# Altium schematic sheet 05-AD9546_StrapsXtal.SchDoc
size A; SheetNumber: 5; SheetTotal: 16
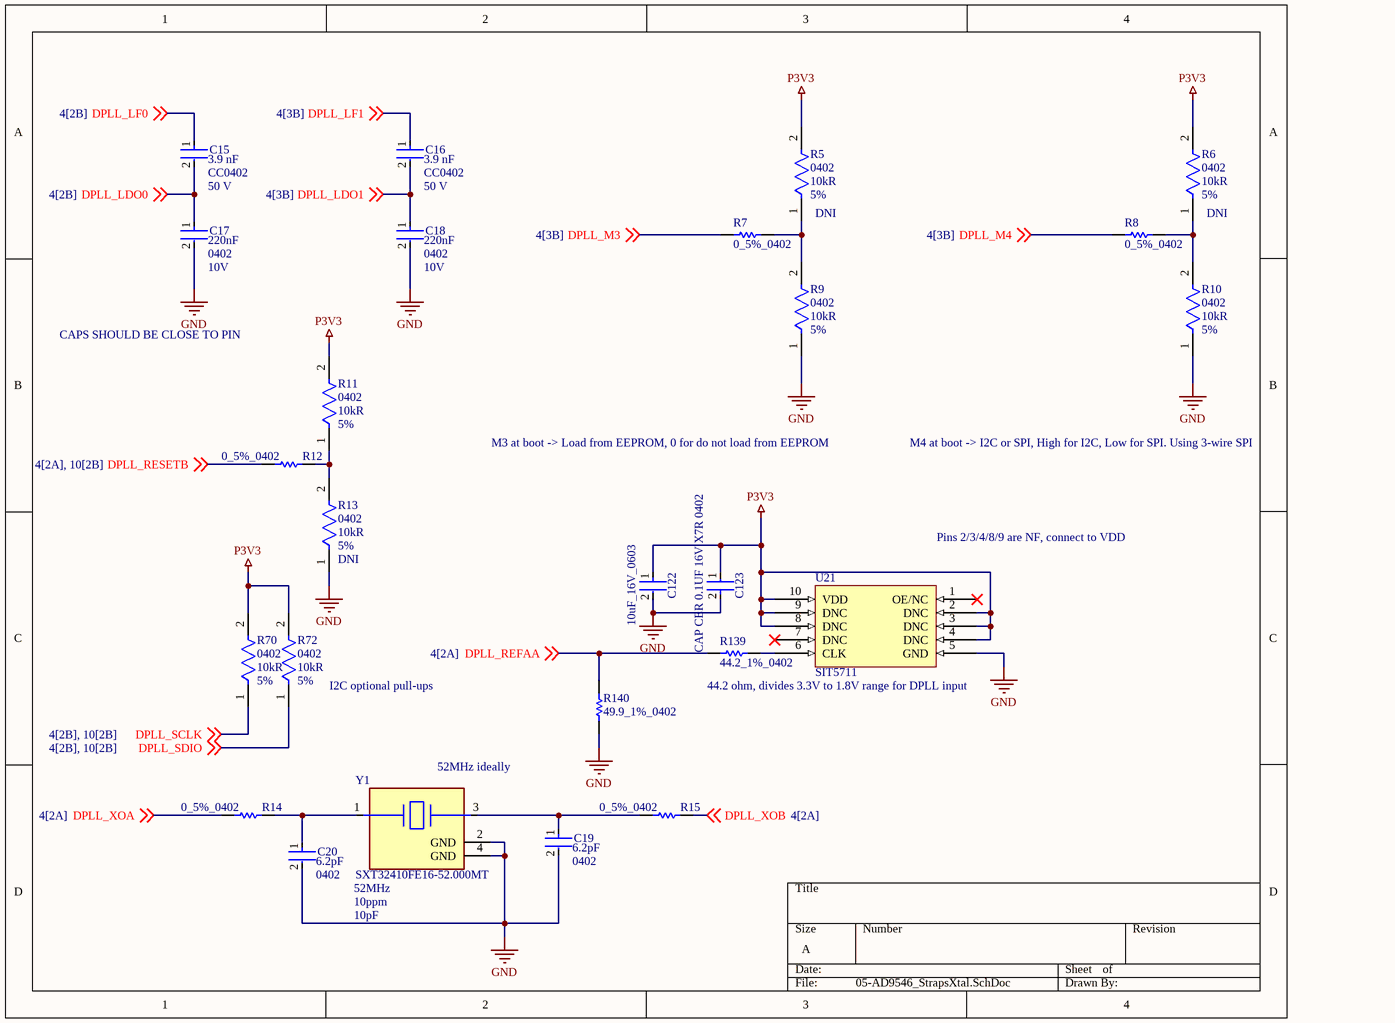
[diagram p0: 05-AD9546_StrapsXtal.SchDoc]

## Parts
C15  value 3.9 nF  Voltage Rating: 50 V  Package: CC0402  [FP-CC0402-MFG]  (hidden comment: CC0402KRX7R9BB392)
C16  value 3.9 nF  Voltage Rating: 50 V  Package: CC0402  [FP-CC0402-MFG]  (hidden comment: CC0402KRX7R9BB392)
C17  Voltage: 10V  Case/Package: 0402  Capacitance: 220nF  [FP-GRM155-0_05-IPC_A]  (hidden comment: GRM155R61A224KE19D)
C18  Voltage: 10V  Case/Package: 0402  Capacitance: 220nF  [FP-GRM155-0_05-IPC_A]  (hidden comment: GRM155R61A224KE19D)
C19  Case/Package: 0402  Capacitance: 6.2pF  [FP-CL468-IPC_C]  (hidden comment: CL05C6R2CB5NNNC)
C20  Case/Package: 0402  Capacitance: 6.2pF  [FP-CL468-IPC_C]  (hidden comment: CL05C6R2CB5NNNC)
C122  10uF_16V_0603  [FP-C1608-MFG]
C123  GRM155R71C104KA88D  [FP-GRM15-MFG]  (value not drawn)
R5  Case/Package: 0402  Resistance: 10kR  Tolerance: 5%  [FP-CRCW0402-e3-IPC_B]  (hidden comment: CRCW040210K0JNED)  (no BOM)
R6  Case/Package: 0402  Resistance: 10kR  Tolerance: 5%  [FP-CRCW0402-e3-IPC_B]  (hidden comment: CRCW040210K0JNED)  (no BOM)
R7  0_5%_0402  [RESC1005X40X25ML05T10]
R8  0_5%_0402  [RESC1005X40X25ML05T10]
R9  Case/Package: 0402  Resistance: 10kR  Tolerance: 5%  [FP-CRCW0402-e3-IPC_B]  (hidden comment: CRCW040210K0JNED)
R10  Case/Package: 0402  Resistance: 10kR  Tolerance: 5%  [FP-CRCW0402-e3-IPC_B]  (hidden comment: CRCW040210K0JNED)
R11  Case/Package: 0402  Resistance: 10kR  Tolerance: 5%  [FP-CRCW0402-e3-IPC_B]  (hidden comment: CRCW040210K0JNED)
R12  0_5%_0402  [RESC1005X40X25LL10T10]
R13  Case/Package: 0402  Resistance: 10kR  Tolerance: 5%  [FP-CRCW0402-e3-IPC_B]  (hidden comment: CRCW040210K0JNED)  (no BOM)
R14  0_5%_0402  [RESC1005X40X25LL10T10]
R15  0_5%_0402  [RESC1005X40X25LL10T10]
R70  Case/Package: 0402  Resistance: 10kR  Tolerance: 5%  [FP-CRCW0402-e3-IPC_B]  (hidden comment: CRCW040210K0JNED)
R72  Case/Package: 0402  Resistance: 10kR  Tolerance: 5%  [FP-CRCW0402-e3-IPC_B]  (hidden comment: CRCW040210K0JNED)
R139  44.2_1%_0402  [RESC0402(1005)_M]
R140  49.9_1%_0402  [RESC1005X40X25NL05T05]
U21  SIT5711  [SIT5711]
Y1  SXT32410FE16-52.000MT  Frequency: 52MHz  Frequency Stability: 10ppm  Load Capacitance: 10pF  [FP-402-MFG]

## Nets
GND: C17.2 C18.2 C19.2 C20.2 C122.2 C123.2 R9.1 R10.1 R13.1 R140.1 U21.5(GND) Y1.2(GND) Y1.4(GND)
P3V3: C122.1 C123.1 R5.2 R6.2 R11.2 R70.2 R72.2 U21.2(DNC) U21.3(DNC) U21.4(DNC) U21.8(DNC) U21.9(DNC) U21.10(VDD)
DPLL_LDO0: C15.2 C17.1 ; off-sheet DPLL_LDO0
DPLL_LDO1: C16.2 C18.1 ; off-sheet DPLL_LDO1
DPLL_LF0: C15.1 ; off-sheet DPLL_LF0
DPLL_LF1: C16.1 ; off-sheet DPLL_LF1
DPLL_M3: R7.1 ; off-sheet DPLL_M3
DPLL_M4: R8.1 ; off-sheet DPLL_M4
DPLL_REFAA: R139.1 R140.2 ; off-sheet DPLL_REFAA
DPLL_RESETB: R12.1 ; off-sheet DPLL_RESETB
DPLL_SCLK: R70.1 ; off-sheet DPLL_SCLK
DPLL_SDIO: R72.1 ; off-sheet DPLL_SDIO
DPLL_XOA: R14.1 ; off-sheet DPLL_XOA
DPLL_XOB: R15.2 ; off-sheet DPLL_XOB
NetC19_1: C19.1 R15.1 Y1.3
NetC20_1: C20.1 R14.2 Y1.1
NetR5_1: R5.1 R7.2 R9.2
NetR6_1: R6.1 R8.2 R10.2
NetR11_1: R11.1 R12.2 R13.2
NetR139_2: R139.2 U21.6(CLK)

Not connected (* = marked no-connect by the designer): U21 1(OE/NC)* 7(DNC)*

## Notes on the sheet
- CAPS SHOULD BE CLOSE TO PIN
- M3 at boot -> Load from EEPROM, 0 for do not load from EEPROM
- M4 at boot -> I2C or SPI, High for I2C, Low for SPI. Using 3-wire SPI
- Pins 2/3/4/8/9 are NF, connect to VDD
- (near R72) I2C optional pull-ups
- 44.2 ohm, divides 3.3V to 1.8V range for DPLL input
- (near Y1) 52MHz ideally

## Library data of the parts
C15 C16 = CMP-03422-000890-1: CAP CER 3900PF 50V X7R 0402; Manufacturer: YAGEO; Tolerance: 0.1; Temperature Coefficient: 30ppm/°C; Material: Ceramic; Automotive Grade: NA; Digikey Description: CAP CER 3900PF 50V X7R 0402; Octopart: https://octopart.com/cc0402krx7r9bb392-yageo-9291741; Category: Cap; Temperature Characteristic: X7R; Footprint Url: http://www.yageo.com/exep/pages/download/literatures/UPY-C_GEN_24.pdf; Height: 0.55mm; ComponentLink2Description: Datasheet; Capacitance: 3.9 nF; RoHS: TRUE; Device Class L1: Passive Components; ComponentLink2URL: http://www.yageo.com/documents/recent/UPY-GP_NP0_16V-to-50V_16.pdf; Temperature Range Low: -55°C; Automotive: No; Manufacturer Part Number: CC0402KRX7R9BB392; Temperature: -55°C to +125°C; Ipc Land Pattern Name: CAPC10050X50; Device Class L3: Ceramic Capacitors; Device Class L2: Capacitors; Mouser Description: Multilayer Ceramic Capacitors MLCC - SMD/SMT 3.9nF 50V X7R 10%; Lead Free: Yes; Temperature Range High: +125°C
C17 C18 = CMP-2008-04561-5: CAP CER 0.22UF 10V X5R 0402; Tolerance: 10%; Material: Ceramic; Insulation Resistance: 10GR; Package Quantity: 1; Termination: SMD/SMT; Max Operating Temperature: 85°C; REACH SVHC: No SVHC; Thickness: 0.022inch; Mount: Surface Mount; Height: 0.5mm; Length: 1mm; Lead Free: Lead Free; Number of Pins: 2; Case Code (Imperial): 0402; Min Operating Temperature: -55°C; Packaging: Tape and Reel; Dielectric: X5R; Depth: 0.5mm; Series: GRM; Case Code (Metric): 1005; Radiation Hardening: No; RoHS Compliant: Yes; Voltage Rating (DC): 10V; Voltage Rating: 10V; Dielectric Material: Ceramic; Width: 0.5mm
C19 C20 = CMP-13271-000420-1: Cap Ceramic 6.2pF 50V C0G ±0.25pF SMD 0402 +125°C Paper T/R; Radiation Hardening: No; Voltage Rating (DC): 50V; Thickness: 0.022inch; Height: 0.5mm; Case Code (Metric): 1005; Max Operating Temperature: 125°C; Case Code (Imperial): 0402; Voltage Rating: 50V; Min Operating Temperature: -55°C; Width: 0.02inch; Depth: 0.5mm; Length: 1mm; Dielectric: C0G; Packaging: Tape and Reel; Mount: Surface Mount
C122 = CMP-08246-000019-1: CAP CER 10UF 16V X5R 0603; Manufacturer: TDK Corporation; Manufacturer Part Number: C1608X5R1C106M080AB; Temperature Coefficient: 15%; Tolerance: 20%; Material: Ceramic; Octopart: https://octopart.com/c1608x5r1c106m080ab-tdk-26013480; ComponentLink2Description: Datasheet; Value: 10uF; Temperature Range Low: -55°C; Digikey Description: CAP CER 10UF 16V X5R 0603; Package: C1608; Lead Free: Yes; Mouser Description: Multilayer Ceramic Capacitors MLCC - SMD/SMT 0603 10uF 16volts X5R +/-20% GP; Device Class L2: Capacitors; Voltage Rating: 16V; RoHS: TRUE; Automotive: No; Height: 0.9mm; Ipc Land Pattern Name: CAPC16080X80; ComponentLink2URL: https://upverter.com/datasheet/6fbac97fd59b4a24a005814037d2a36a27db40e9.pdf; Temperature Range High: +85°C; Capacitance: 10uF; Temperature: -55°C to +85°C; Category: Cap; Device Class L1: Passive Components; Device Class L3: Ceramic Capacitors; Temperature Characteristic: X5R
C123 = CMP-2100-03641-2: CAP CER 0.1UF 16V X7R 0402; Manufacturer: Murata; Standoff Height: 0mm; Tolerance: 10%; Voltage Rating: 16Vdc; Material: Ceramic; Capacitance: 0.10μF; Value: 0.10μF; RoHS: TRUE; Manufacturer Part Number: GRM155R71C104KA88D; Temperature Characteristic: X7R; Octopart: https://octopart.com/grm155r71c104ka88d-murata-196880; Digikey Description: CAP CER 0.1UF 16V X7R 0402; Device Class L3: Ceramic Capacitors; Height: 0.55mm; ComponentLink2Description: Datasheet; Temperature Range Low: -55°C; Ipc Land Pattern Name: CAPC10050X219; ComponentLink2URL: https://search.murata.co.jp/Ceramy/image/img/A01X/G101/ENG/GRM155R71H471KA01-01A.pdf; Device Class L1: Passive Components; Lead Free: yes; Category: Cap; Package: GRM15; Temperature: -55°C to +125°C; Device Class L2: Capacitors; Temperature Range High: +125°C; Mouser Description: 0402 0.1 uF 16V ±10 % Tolerance X7R SMT Multilayer Ceramic Capacitor
R5 R6 R9-R11 R13 R70 R72 = CMP-2002-08136-3: RES Thick Film, 10kΩ, 5%, 0.063W, 200ppm/°C, 0402; Voltage Rating: 50V; Power Rating: 63mW; Military Standard: Not; Packaging: Tape and Reel; Case Code (Imperial): 0402; Min Operating Temperature: -55°C; Case Code (Metric): 1005; Temperature Coefficient: 200ppm/°C; Termination: SMD/SMT; Composition: Thick Film; Depth: 0.5mm; Number of Terminations: 2; Contact Plating: Tin; Height: 0.016inch; Width: 0.5mm; Max Operating Temperature: 155°C; Features: Automotive AEC-Q200; Length: 1mm; Radiation Hardening: No; Max Power Dissipation: 63mW; Mount: Surface Mount; Package Quantity: 1; Weight: 2.3E-05oz
  R5 R6 R13: DNI: DNI
R7 R8 = CMP-2002-03041-1: Part Number: CRCW04020000Z0EDHP; Manufacturer: Vishay Dale
R12 R14 R15 = CMP-2002-04569-1: Manufacturer: KOA Speer; Part Number: RK73Z1ETTP
R139 = CMP-1011-00357-1: 44R2 0.063W 1% 0402 (1005 Metric)  SMD; Case-Metric: 1005; Value: 44.20 Ohm; Case-EIA: 0402; Tolerance: 1 %; Technology: SMT; Power: 0.063 W
R140 = CMP-2002-00969-1: Manufacturer: Panasonic; Part Number: ERJ-2RKF49R9X
Y1 = CMP-06858-000005-1: CRYSTAL 32.0000MHZ 10PF SMD; Series Resistance: 100R; Width: 0.063inch; Height: 0.022inch; Frequency Tolerance: 10ppm; Length: 0.079inch; Contact Plating: Gold; Package Quantity: 3000; Case/Package: SMD/SMT; ESR (Equivalent Series Resistance): 100R; Min Operating Temperature: -20°C; Tolerance: 10ppm; Packaging: Tape and Reel; Max Operating Temperature: 70°C; Mount: Surface Mount; Termination: SMD/SMT